# EAGLE schematic register (EAGLE 9.6.2)
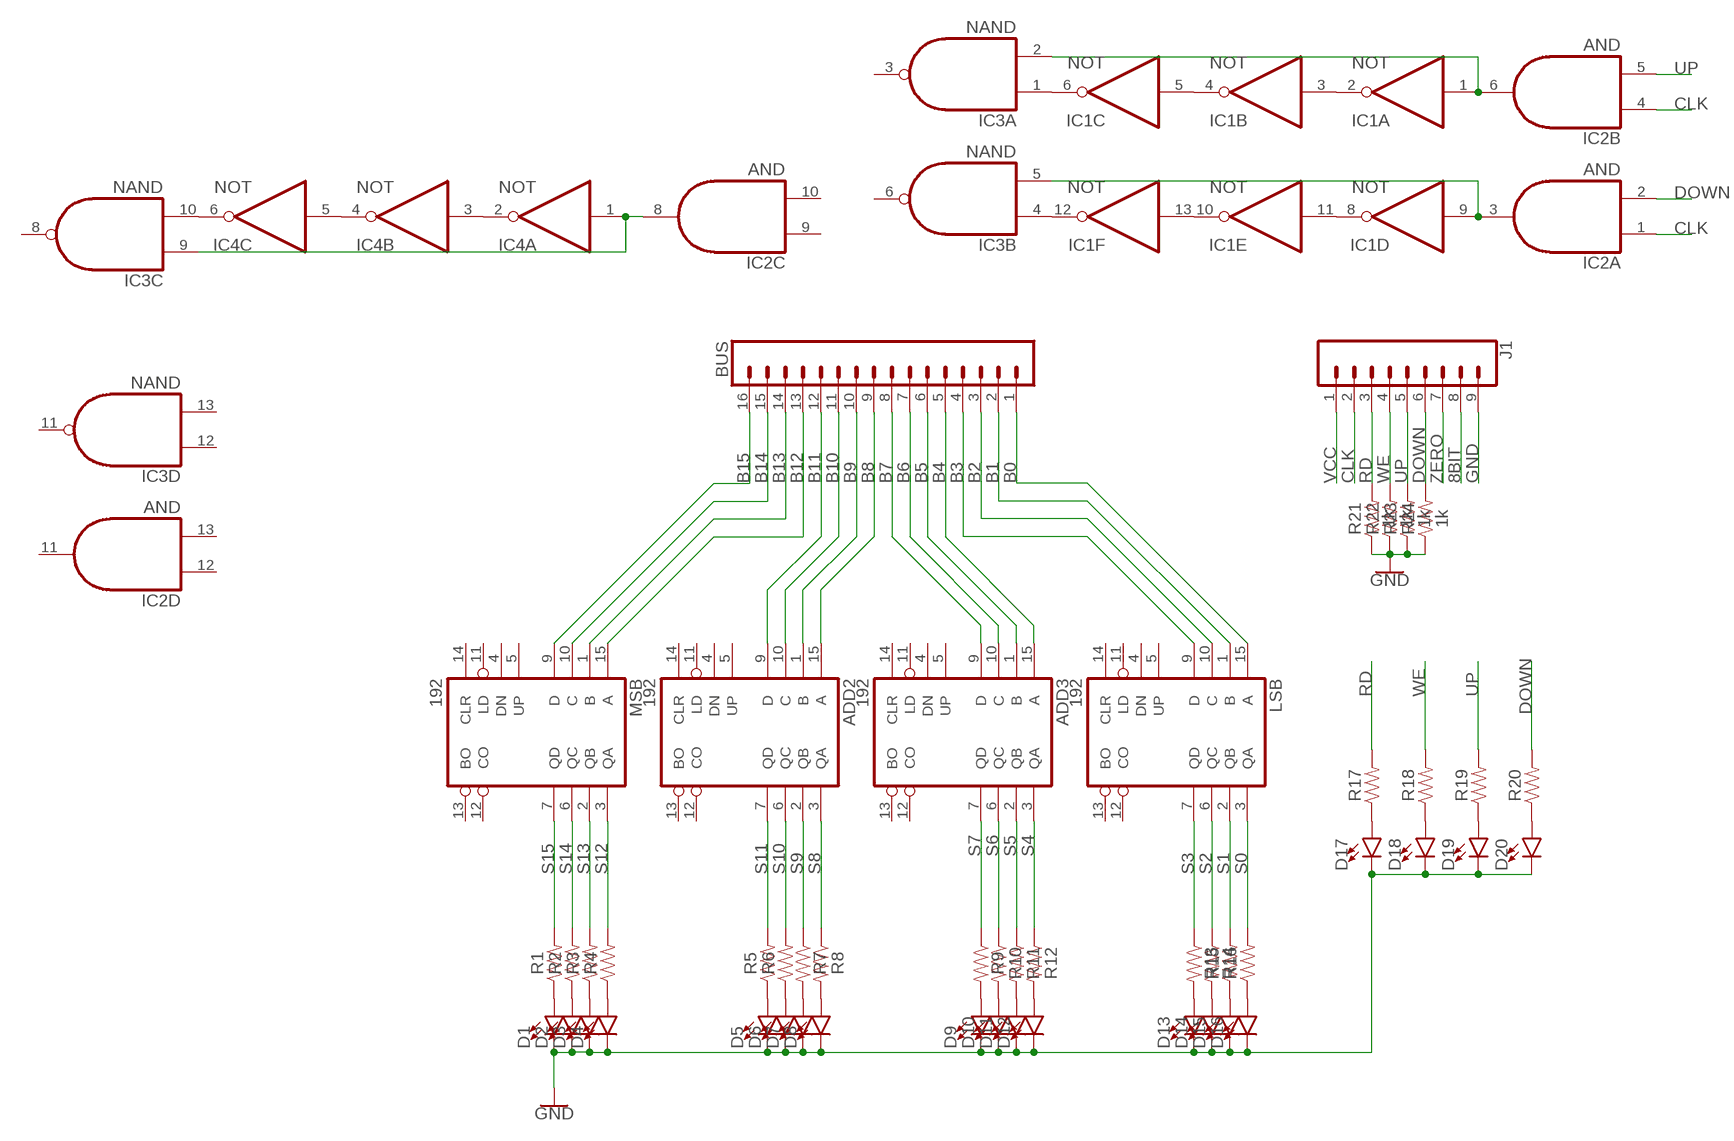
[diagram p0: schematic, sheet 1]

## Parts
ADD2  192  74LS192N  [DIL16]
ADD3  192  74LS192N  [DIL16]
BUS  CONN_16  [1X16]
D1  LED5MM  [LED_5MM]
D2  LED5MM  [LED_5MM]
D3  LED5MM  [LED_5MM]
D4  LED5MM  [LED_5MM]
D5  LED5MM  [LED_5MM]
D6  LED5MM  [LED_5MM]
D7  LED5MM  [LED_5MM]
D8  LED5MM  [LED_5MM]
D9  LED5MM  [LED_5MM]
D10  LED5MM  [LED_5MM]
D11  LED5MM  [LED_5MM]
D12  LED5MM  [LED_5MM]
D13  LED5MM  [LED_5MM]
D14  LED5MM  [LED_5MM]
D15  LED5MM  [LED_5MM]
D16  LED5MM  [LED_5MM]
D17  LED5MM  [LED_5MM]
D18  LED5MM  [LED_5MM]
D19  LED5MM  [LED_5MM]
D20  LED5MM  [LED_5MM]
IC1  NOT  74ALS04N  [DIL14]
IC2  AND  74ALS08N  [DIL14]
IC3  NAND  74ALS00N  [DIL14]
IC4  NOT  74ALS04N  [DIL14]
J1  CONN_09  [1X09]
LSB  192  74LS192N  [DIL16]
MSB  192  74LS192N  [DIL16]
R1  RESISTORAXIAL-0.3  [AXIAL-0.3]
R2  RESISTORAXIAL-0.3  [AXIAL-0.3]
R3  RESISTORAXIAL-0.3  [AXIAL-0.3]
R4  RESISTORAXIAL-0.3  [AXIAL-0.3]
R5  RESISTORAXIAL-0.3  [AXIAL-0.3]
R6  RESISTORAXIAL-0.3  [AXIAL-0.3]
R7  RESISTORAXIAL-0.3  [AXIAL-0.3]
R8  RESISTORAXIAL-0.3  [AXIAL-0.3]
R9  RESISTORAXIAL-0.3  [AXIAL-0.3]
R10  RESISTORAXIAL-0.3  [AXIAL-0.3]
R11  RESISTORAXIAL-0.3  [AXIAL-0.3]
R12  RESISTORAXIAL-0.3  [AXIAL-0.3]
R13  RESISTORAXIAL-0.3  [AXIAL-0.3]
R14  RESISTORAXIAL-0.3  [AXIAL-0.3]
R15  RESISTORAXIAL-0.3  [AXIAL-0.3]
R16  RESISTORAXIAL-0.3  [AXIAL-0.3]
R17  RESISTORAXIAL-0.3  [AXIAL-0.3]
R18  RESISTORAXIAL-0.3  [AXIAL-0.3]
R19  RESISTORAXIAL-0.3  [AXIAL-0.3]
R20  RESISTORAXIAL-0.3  [AXIAL-0.3]
R21  1k  RESISTORAXIAL-0.3  [AXIAL-0.3]
R22  1k  RESISTORAXIAL-0.3  [AXIAL-0.3]
R23  1k  RESISTORAXIAL-0.3  [AXIAL-0.3]
R24  1k  RESISTORAXIAL-0.3  [AXIAL-0.3]

## Nets
8BIT: J1.8
B0: BUS.1 LSB.15(A)
B1: BUS.2 LSB.1(B)
B2: BUS.3 LSB.10(C)
B3: BUS.4 LSB.9(D)
B4: ADD3.15(A) BUS.5
B5: ADD3.1(B) BUS.6
B6: ADD3.10(C) BUS.7
B7: ADD3.9(D) BUS.8
B8: ADD2.15(A) BUS.9
B9: ADD2.1(B) BUS.10
B10: ADD2.10(C) BUS.11
B11: ADD2.9(D) BUS.12
B12: BUS.13 MSB.15(A)
B13: BUS.14 MSB.1(B)
B14: BUS.15 MSB.10(C)
B15: BUS.16 MSB.9(D)
CLK: IC2.1(A:I0) IC2.4(B:I0) J1.2
DOWN: IC2.2(A:I1) J1.6 R20.P$2 R24.P$2
GND: D1.K(C) D2.K(C) D3.K(C) D4.K(C) D5.K(C) D6.K(C) D7.K(C) D8.K(C) D9.K(C) D10.K(C) D11.K(C) D12.K(C) D13.K(C) D14.K(C) D15.K(C) D16.K(C) D17.K(C) D18.K(C) D19.K(C) D20.K(C) J1.9 R21.P$1 R22.P$1 R23.P$1 R24.P$1
N$1: IC1.2(A:O) IC1.3(B:I)
N$2: IC1.4(B:O) IC1.5(C:I)
N$3: IC1.8(D:O) IC1.11(E:I)
N$4: IC1.10(E:O) IC1.13(F:I)
N$5: IC1.9(D:I) IC2.3(A:O) IC3.5(B:I1)
N$6: IC1.1(A:I) IC2.6(B:O) IC3.2(A:I1)
N$7: IC1.6(C:O) IC3.1(A:I0)
N$8: IC1.12(F:O) IC3.4(B:I0)
N$9: IC4.2(A:O) IC4.3(B:I)
N$10: IC4.4(B:O) IC4.5(C:I)
N$11: IC2.8(C:O) IC3.9(C:I0) IC4.1(A:I)
N$12: IC3.10(C:I1) IC4.6(C:O)
N$29: D1.A R1.P$1
N$30: D2.A R2.P$1
N$31: D3.A R3.P$1
N$32: D4.A R4.P$1
N$33: D5.A R5.P$1
N$34: D6.A R6.P$1
N$35: D7.A R7.P$2
N$36: D8.A R8.P$2
N$37: D9.A R9.P$2
N$38: D10.A R10.P$2
N$39: D11.A R11.P$2
N$40: D12.A R12.P$2
N$41: D13.A R13.P$2
N$42: D14.A R14.P$2
N$43: D15.A R15.P$1
N$44: D16.A R16.P$1
N$45: D18.A R18.P$1
N$46: D19.A R19.P$1
N$47: D20.A R20.P$1
N$48: D17.A R17.P$1
RD: J1.3 R17.P$2 R21.P$2
S0: LSB.3(QA) R16.P$2
S1: LSB.2(QB) R15.P$2
S2: LSB.6(QC) R14.P$1
S3: LSB.7(QD) R13.P$1
S4: ADD3.3(QA) R12.P$1
S5: ADD3.2(QB) R11.P$1
S6: ADD3.6(QC) R10.P$1
S7: ADD3.7(QD) R9.P$1
S8: ADD2.3(QA) R8.P$1
S9: ADD2.2(QB) R7.P$1
S10: ADD2.6(QC) R6.P$2
S11: ADD2.7(QD) R5.P$2
S12: MSB.3(QA) R4.P$2
S13: MSB.2(QB) R3.P$2
S14: MSB.6(QC) R2.P$2
S15: MSB.7(QD) R1.P$2
UP: IC2.5(B:I1) J1.5 R19.P$2 R23.P$2
VCC: J1.1
WE: J1.4 R18.P$2 R22.P$2
ZERO: J1.7
Unconnected: ADD2.4(DN) ADD2.5(UP) ADD2.11(LD) ADD2.12(CO) ADD2.13(BO) ADD2.14(CLR) ADD3.4(DN) ADD3.5(UP) ADD3.11(LD) ADD3.12(CO) ADD3.13(BO) ADD3.14(CLR) IC2.9(C:I0) IC2.10(C:I1) IC2.11(D:O) IC2.12(D:I0) IC2.13(D:I1) IC3.3(A:O) IC3.6(B:O) IC3.8(C:O) IC3.11(D:O) IC3.12(D:I0) IC3.13(D:I1) IC4.8(D:O) IC4.9(D:I) IC4.10(E:O) IC4.11(E:I) IC4.12(F:O) IC4.13(F:I) LSB.4(DN) LSB.5(UP) LSB.11(LD) LSB.12(CO) LSB.13(BO) LSB.14(CLR) MSB.4(DN) MSB.5(UP) MSB.11(LD) MSB.12(CO) MSB.13(BO) MSB.14(CLR)

## Power pins joined to a net without a drawn wire
GND: ADD2.8(GND) ADD3.8(GND) IC1.7(P:GND) IC2.7(P:GND) IC3.7(P:GND) IC4.7(P:GND) LSB.8(GND) MSB.8(GND)
VCC: ADD2.16(VCC) ADD3.16(VCC) IC1.14(P:VCC) IC2.14(P:VCC) IC3.14(P:VCC) IC4.14(P:VCC) LSB.16(VCC) MSB.16(VCC)

## Library data of the parts
ADD2 ADD3 LSB MSB = 74xx-us:74*192: Synchronous 4-bit UP/DOWN COUNTER
BUS = SparkFun-Connectors:CONN_16: Multi connection point. Often used as Generic Header-pin footprint for 0.1 inch spaced/style header connections On any of the 0.1 inch spaced packages, you can populate with these: Break Away Headers - Straight <https://www.sparkfun.com/products/116> (PRT-00116) Break Away Male Headers - Right Angle <https://www.sparkfun.com/products/553> (PRT-00553) Female Headers <https://www.sparkfun.com/products/115> (PRT-00115) Break Away Headers - Machine Pin <https://www.sparkfun.com/products/117> (PRT-00117) Break Away Female Headers - Swiss Machine Pin <https://www.sparkfun.com/products/743> (PRT-00743) For SCREWTERMINALS and SPRING TERMINALS visit here: Screw Terimnals on SparkFun.com <https://www.sparkfun.com/search/results?term=Screw+Terminals> (5mm/3.5mm/2.54mm spacing) This device is also useful as a general connection point to wire up your design to another part of your project. Our various solder wires solder well into these plated through hole pads. Hook-Up Wire - Assortment (Stranded, 22 AWG) <https://www.sparkfun.com/products/11375> (PRT-11375) Hook-Up Wire - Assortment (Solid Core, 22 AWG) <https://www.sparkfun.com/products/11367> (PRT-11367) View the entire wire category on our website here <https://www.sparkfun.com/categories/141> Special notes: Molex polarized connector foot print use with SKU : PRT-08231 with associated crimp pins and housings. 1MM SMD Version SKU: PRT-10208 NOTES ON THE VARIANTS LOCK and LOCK_LONGPADS... This footprint was designed to help hold the alignment of a through-hole component (i.e. 6-pin header) while soldering it into place. You may notice that each hole has been shifted either up or down by 0.005 of an inch from it's more standard position (which is a perfectly straight line). This slight alteration caused the pins (the squares in the middle) to touch the edges of the holes. Because they are alternating, it causes a "brace" to hold the component in place. 0.005 has proven to be the perfect amount of "off-center" position when using our standard breakaway headers. Although looks a little odd when you look at the bare footprint, once you have a header in there, the alteration is very hard to notice. Also,if you push a header all the way into place, it is covered up entirely on the bottom side.
D1-D20 = SparkFun-LED:LED: LED (Generic) Standard schematic elements and footprints for 5mm, 3mm, 1206, and 0603 sized LEDs. Generic LEDs with no color specified.
IC1 IC4 = 74xx-us:74*04: Hex INVERTER
IC2 = 74xx-us:74*08: Quad 2-input AND gate
IC3 = 74xx-us:74*00: Quad 2-input NAND gate
J1 = SparkFun-Connectors:CONN_09: Multi connection point. Often used as Generic Header-pin footprint for 0.1 inch spaced/style header connections On any of the 0.1 inch spaced packages, you can populate with these: Break Away Headers - Straight <https://www.sparkfun.com/products/116> (PRT-00116) Break Away Male Headers - Right Angle <https://www.sparkfun.com/products/553> (PRT-00553) Female Headers <https://www.sparkfun.com/products/115> (PRT-00115) Break Away Headers - Machine Pin <https://www.sparkfun.com/products/117> (PRT-00117) Break Away Female Headers - Swiss Machine Pin <https://www.sparkfun.com/products/743> (PRT-00743) For SCREWTERMINALS and SPRING TERMINALS visit here: Screw Terimnals on SparkFun.com <https://www.sparkfun.com/search/results?term=Screw+Terminals> (5mm/3.5mm/2.54mm spacing) This device is also useful as a general connection point to wire up your design to another part of your project. Our various solder wires solder well into these plated through hole pads. Hook-Up Wire - Assortment (Stranded, 22 AWG) <https://www.sparkfun.com/products/11375> (PRT-11375) Hook-Up Wire - Assortment (Solid Core, 22 AWG) <https://www.sparkfun.com/products/11367> (PRT-11367) View the entire wire category on our website here <https://www.sparkfun.com/categories/141> Special notes: Molex polarized connector foot print use with SKU : PRT-08231 with associated crimp pins and housings. 1MM SMD Version SKU: PRT-10208 NOTES ON THE VARIANTS LOCK and LOCK_LONGPADS... This footprint was designed to help hold the alignment of a through-hole component (i.e. 6-pin header) while soldering it into place. You may notice that each hole has been shifted either up or down by 0.005 of an inch from it's more standard position (which is a perfectly straight line). This slight alteration caused the pins (the squares in the middle) to touch the edges of the holes. Because they are alternating, it causes a "brace" to hold the component in place. 0.005 has proven to be the perfect amount of "off-center" position when using our standard breakaway headers. Although looks a little odd when you look at the bare footprint, once you have a header in there, the alteration is very hard to notice. Also,if you push a header all the way into place, it is covered up entirely on the bottom side.
R1-R24 = SparkFun-Resistors:RESISTOR: Generic Resistor Package